# EAGLE design 16out_24V_4TE (EAGLE 5.04)
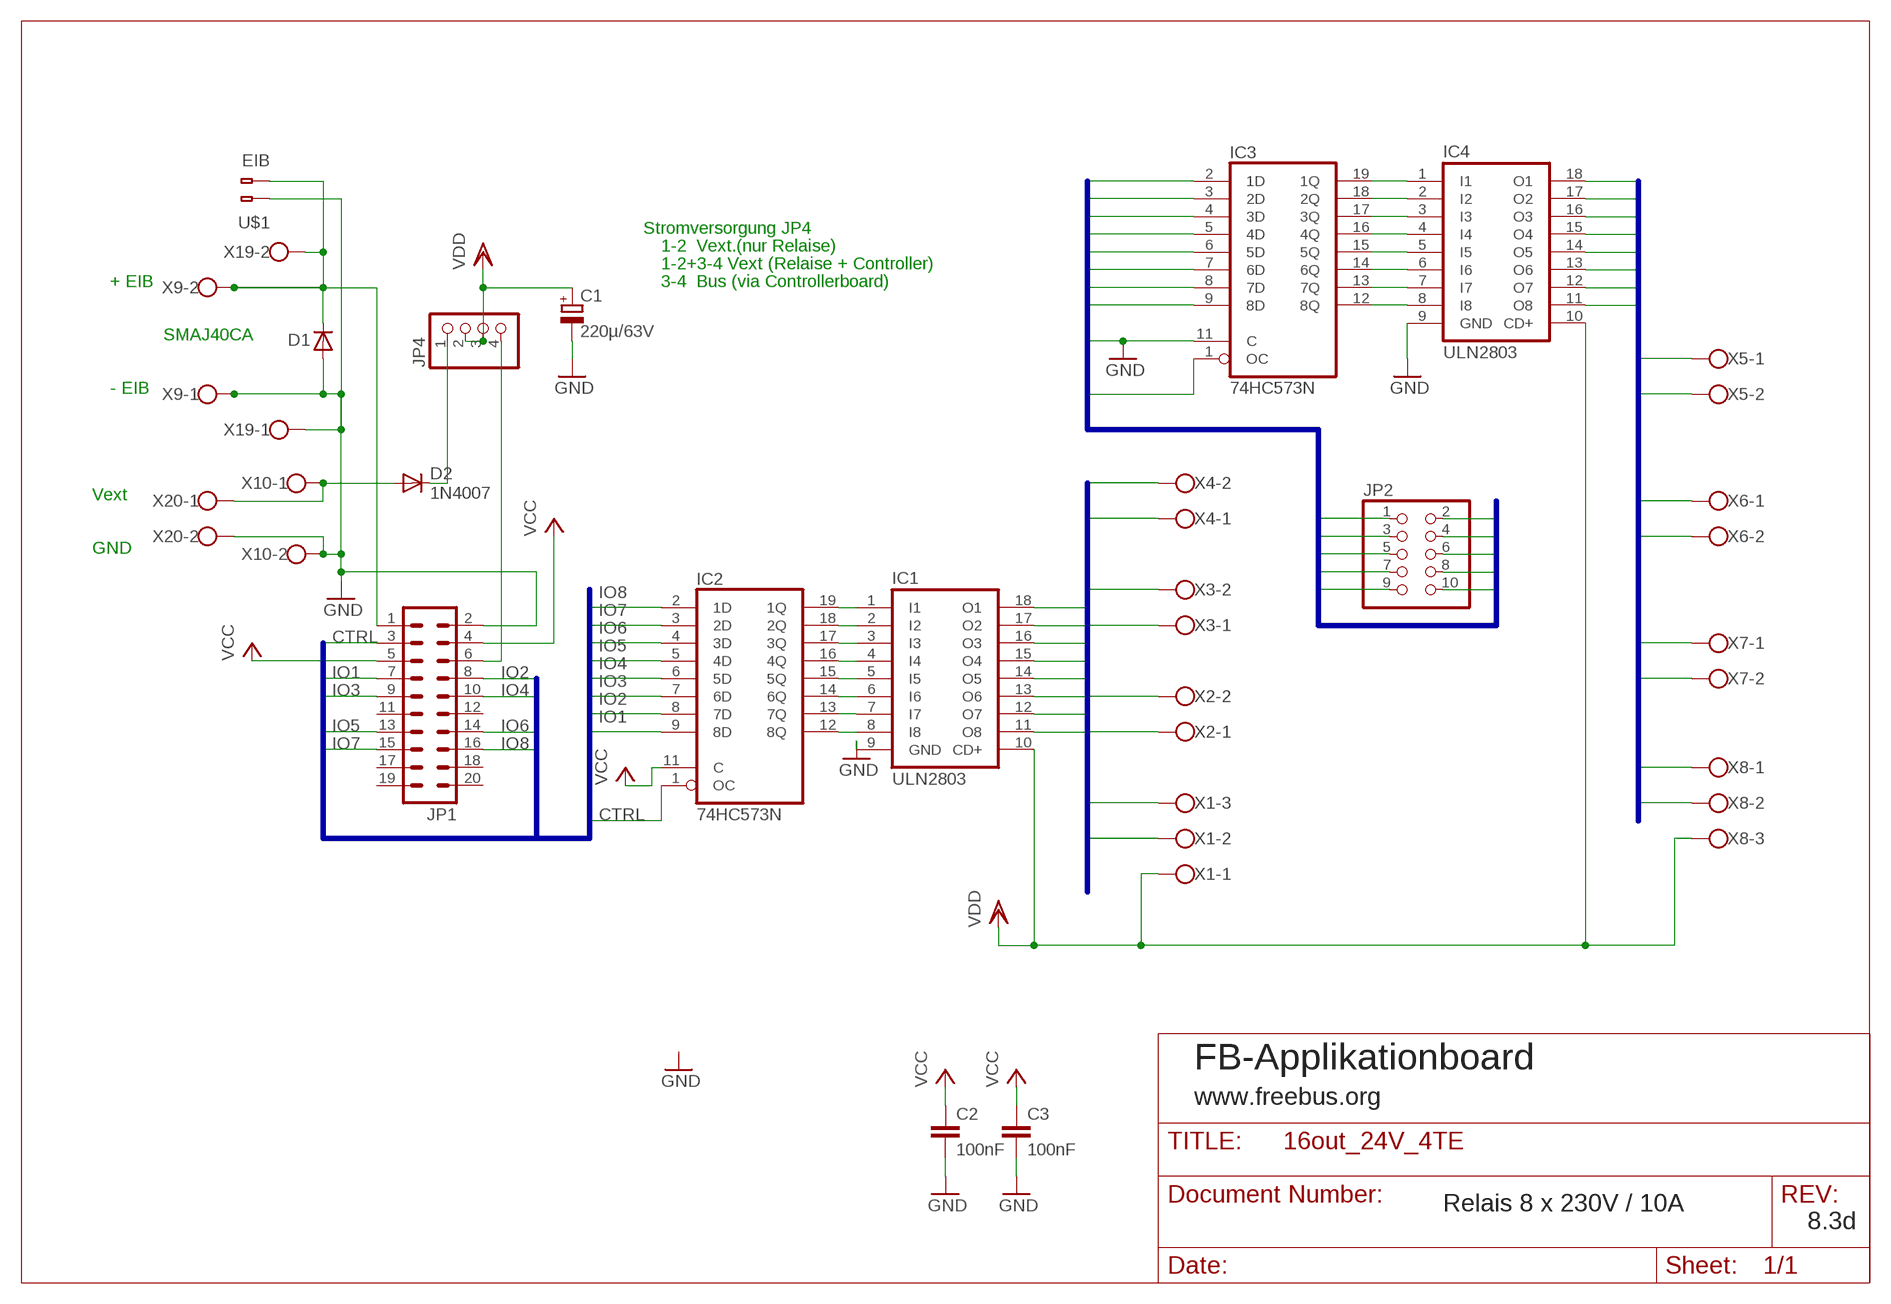
[diagram p0: schematic, sheet 1]

## Parts
C1  220µ/63V  CPOL-EUE5-10.5  [E5-10,5]
C2  100nF  C-EU050-024X044  [C050-024X044]
C3  100nF  C-EU050-024X044  [C050-024X044]
D1  D-SMB  [SMB]
D2  1N4007  1N4004  [DO41-10]
IC1  ULN2803  ULN2803A  [DIL18]
IC2  74HC573N  [DIL20]
IC3  74HC573N  [DIL20]
IC4  ULN2803  ULN2803A  [DIL18]
JP1  ML20  [ML20]
JP2  PINHD-2X5  [2X05]
JP4  PINHD-1X4  [1X04]
U$1  EIB  [BUSKLEMME243-724]
X1  W237-03P  [W237-133]
X2  W237-102  [W237-102]
X3  W237-102  [W237-102]
X4  W237-102  [W237-102]
X5  W237-102  [W237-102]
X6  W237-102  [W237-102]
X7  W237-102  [W237-102]
X8  W237-03P  [W237-133]
X9  W237-102  [W237-102]
X10  W237-102  [W237-102]
X19  W237-102AKL007-2P  [AKL007-02]
X20  W237-102AKL007-2P  [AKL007-02]

## Nets
CTRL: IC2.1(OC) JP1.3
GND: C1.- C2.2 C3.2 D1.2(A) IC1.9(GND) IC3.11(C) IC4.9(GND) JP1.2 JP2.9 U$1.1(B-1) X9.1 X10.2 X19.1 X20.2
IO1: IC2.9(8D) JP1.7
IO2: IC2.8(7D) JP1.8
IO3: IC2.7(6D) JP1.9
IO4: IC2.6(5D) JP1.10
IO5: IC2.5(4D) JP1.13
IO6: IC2.4(3D) JP1.14
IO7: IC2.3(2D) JP1.15
IO8: IC2.2(1D) JP1.16
IO9: IC3.9(8D) JP2.1
IO10: IC3.8(7D) JP2.2
IO11: IC3.7(6D) JP2.3
IO12: IC3.6(5D) JP2.4
IO13: IC3.5(4D) JP2.5
IO14: IC3.4(3D) JP2.6
IO15: IC3.3(2D) JP2.7
IO16: IC3.2(1D) JP2.8
N$1: IC3.19(1Q) IC4.1(I1)
N$2: IC3.18(2Q) IC4.2(I2)
N$3: IC3.17(3Q) IC4.3(I3)
N$4: IC3.16(4Q) IC4.4(I4)
N$5: IC3.15(5Q) IC4.5(I5)
N$6: IC3.14(6Q) IC4.6(I6)
N$7: IC3.13(7Q) IC4.7(I7)
N$8: IC3.12(8Q) IC4.8(I8)
N$17: D2.A X10.1 X20.1
N$20: D1.1(C) JP1.1 U$1.2(B-2) X9.2 X19.2
N$25: D2.C JP4.1
N$27: JP1.4
N$29: JP1.6 JP4.4
N$30: IC1.1(I1) IC2.19(1Q)
N$31: IC1.2(I2) IC2.18(2Q)
N$32: IC1.3(I3) IC2.17(3Q)
N$33: IC1.4(I4) IC2.16(4Q)
N$34: IC1.5(I5) IC2.15(5Q)
N$36: IC1.6(I6) IC2.14(6Q)
N$37: IC1.7(I7) IC2.13(7Q)
N$38: IC1.8(I8) IC2.12(8Q)
PWM: IC3.1(OC) JP2.10
R1: IC1.11(O8) X1.2
R2: IC1.12(O7) X1.3
R3: IC1.13(O6) X2.1
R4: IC1.14(O5) X2.2
R5: IC1.15(O4) X3.1
R6: IC1.16(O3) X3.2
R7: IC1.17(O2) X4.1
R8: IC1.18(O1) X4.2
R9: IC4.11(O8) X5.1
R10: IC4.12(O7) X5.2
R11: IC4.13(O6) X6.1
R12: IC4.14(O5) X6.2
R13: IC4.15(O4) X7.1
R14: IC4.16(O3) X7.2
R15: IC4.17(O2) X8.1
R16: IC4.18(O1) X8.2
VCC: C2.1 C3.1 IC2.11(C) JP1.5
VDD: C1.+ IC1.10(CD+) IC4.10(CD+) JP4.2 JP4.3 X1.1 X8.3
Unconnected: JP1.11 JP1.12 JP1.17 JP1.18 JP1.19 JP1.20

## Buses
R[1..8]
IO[1..8],CTRL
R[9..16]
IO[9..16],PWM,GND

## Notes on the sheet
- Stromversorgung JP4
- 1-2  Vext.(nur Relaise)
- 1-2+3-4 Vext (Relaise + Controller)
- + EIB | 3-4  Bus (via Controllerboard)
- SMAJ40CA
- - EIB
- Vext
- GND
- FB-Applikationboard
- www.freebus.org
- Relais 8 x 230V / 10A
- 8.3d

## Power pins joined to a net without a drawn wire
GND: IC2.10(GND) IC3.10(GND)
VCC: IC2.20(VCC) IC3.20(VCC)

## Library data of the parts
C1 = rcl:CPOL-EU: POLARIZED CAPACITOR, European symbol
C2 C3 = rcl:C-EU: CAPACITOR, European symbol
D1 = semicon-smd-ipc:D-: DIODE unfilled
D2 = diode:1N4004: DIODE general purpose rectifier, 1 A
IC1 IC4 = uln-udn:ULN2803A: DRIVER ARRAY
IC2 IC3 = 74xx-eu:74*573: 8-bit D latch BUS DRIVER
JP1 = con-harting-ml:ML20: HARTING
JP2 = pinhead:PINHD-2X5: PIN HEADER
JP4 = pinhead:PINHD-1X4: PIN HEADER
U$1 = con-wago:EIB
X1 X8 = con-wago-508:W237-03P: WAGO SREW CLAMP
X2-X7 X9 X10 X19 X20 = con-wago-500:W237-102: WAGO SCREW CLAMP

## Net classes
0 SELV: width 0.406 mm
1 230Vac: width 1.93 mm, clearance 5.08 mm to class 0, clearance 1.905 mm

## Board
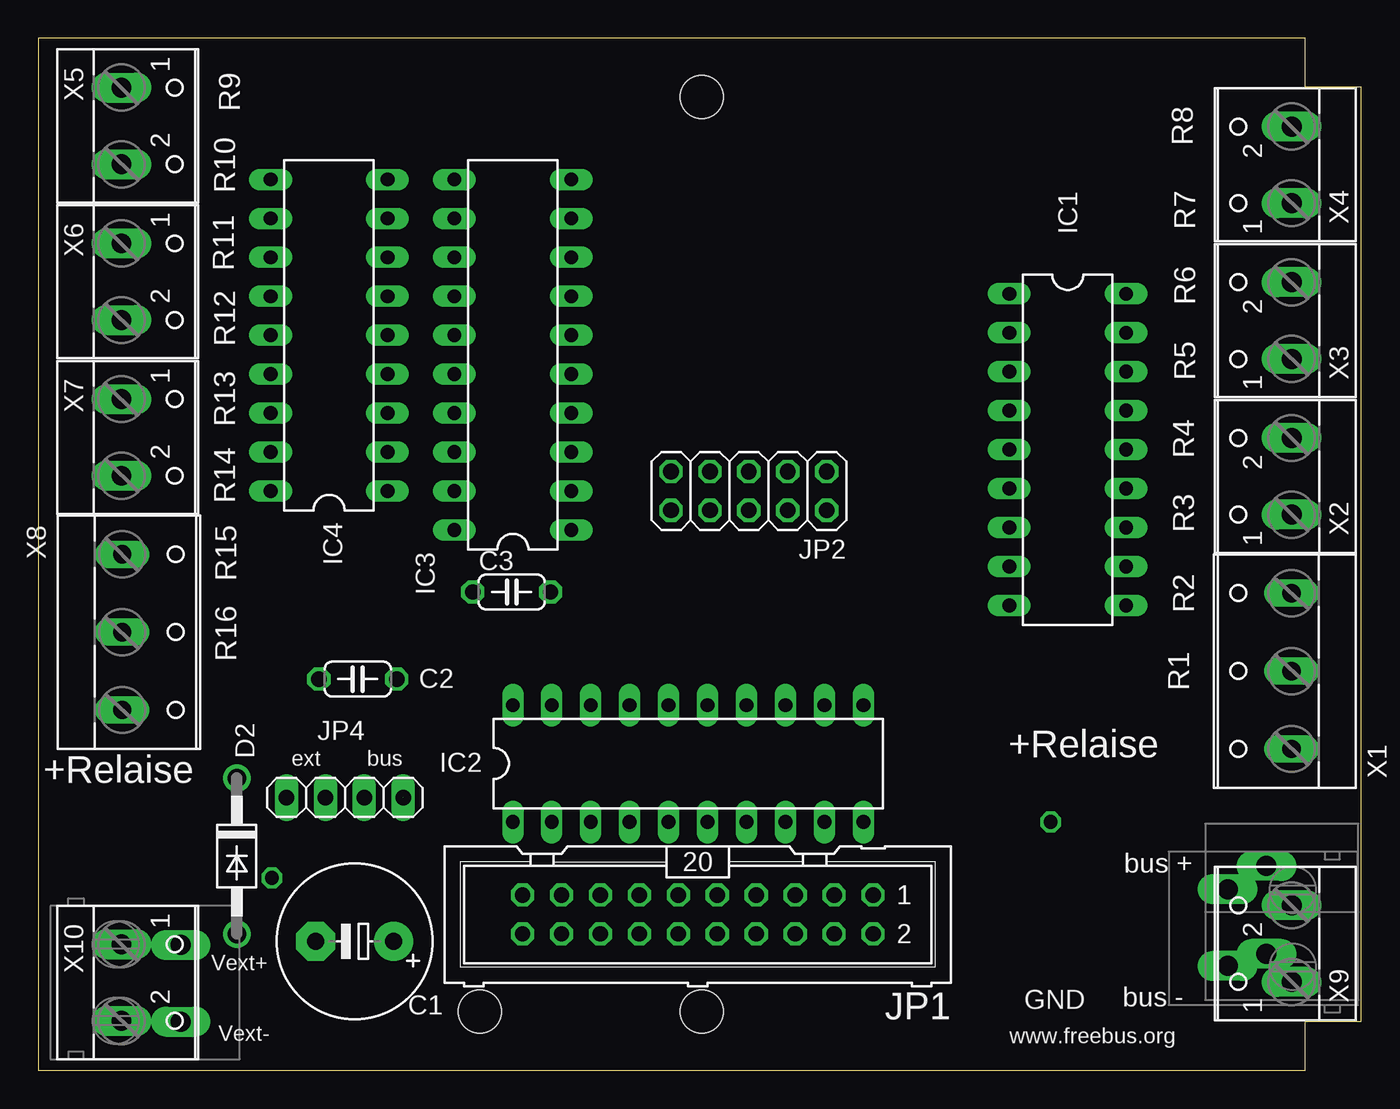
[diagram p1: board, top side]
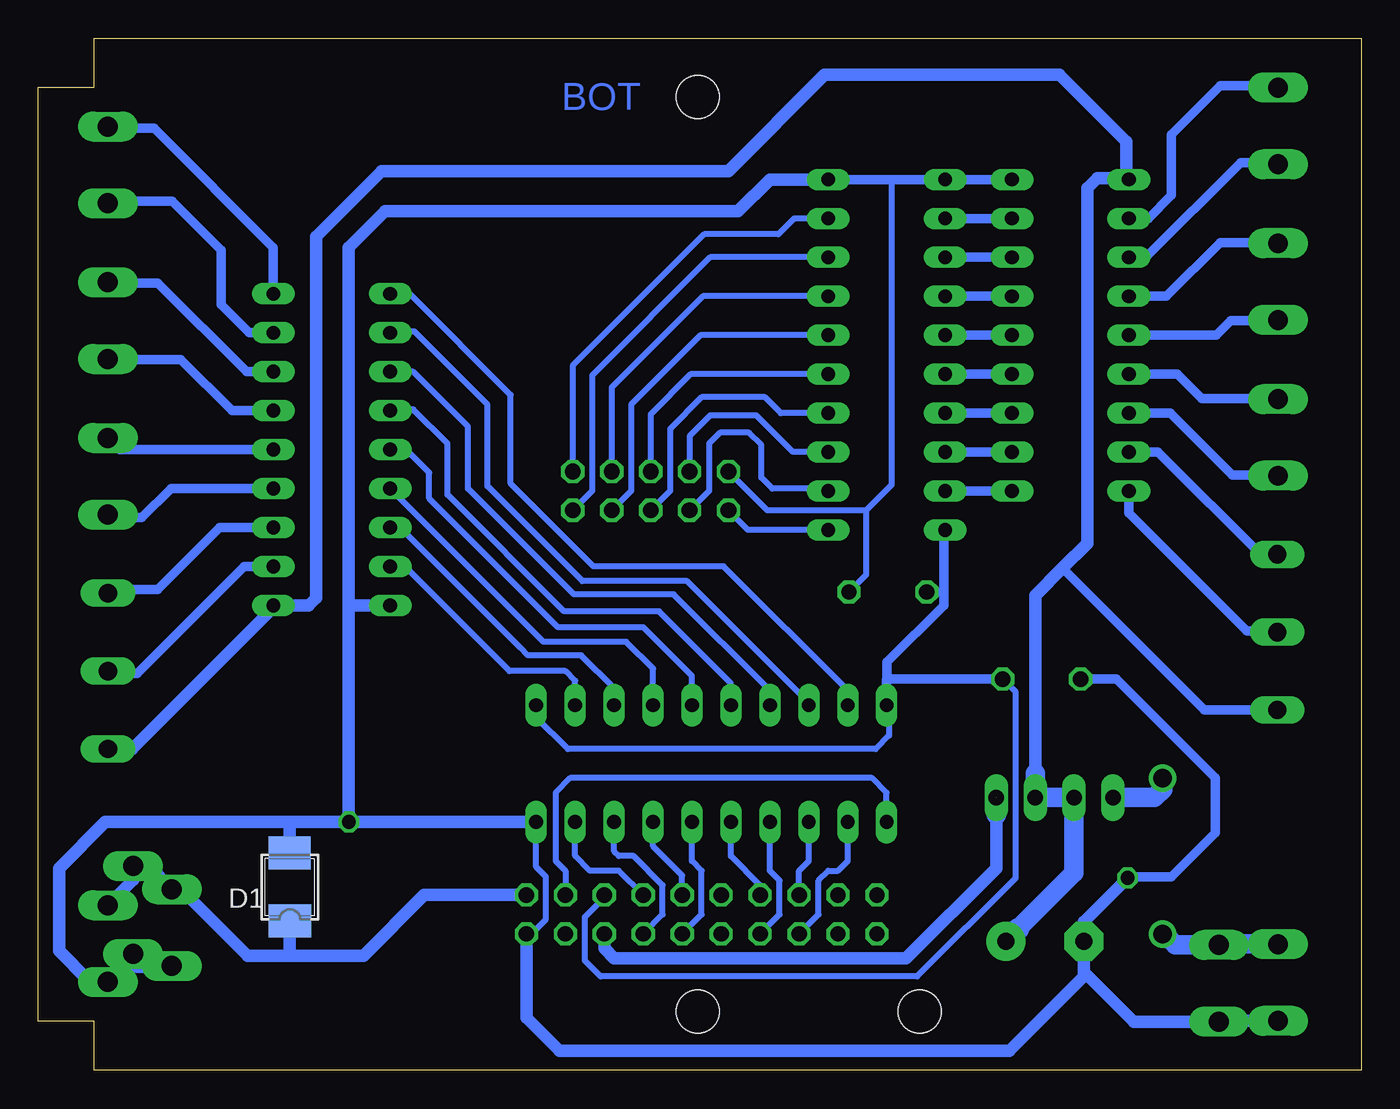
[diagram p2: board, bottom side, seen from below]

Size 86.28 x 67.31 mm. Coordinates in mm from the lower left corner, seen from the top.
Outline: 0,0.01 82.64,0 82.64,3.18 86.28,3.18 86.28,64.13 82.64,64.13 82.64,67.31 0,67.31 0,0.01
Copper layers (1*16): Top 0.035mm / dielectric 1.5mm / Bottom 0.035mm
Design rules "default": minimum track width 10mil, minimum drill 24mil, track to track 16mil, track to pad 12mil, pad to pad 16mil, via to via 16mil, smd to smd 8mil, copper to edge 20mil, drill to drill 10mil, minimum pad ring 10mil, minimum via ring 8mil, stop-mask expansion 4mil, vias tented up to drill 0mil, thermal gap 10mil
Holes 2.8 mm at 43.27,3.81 43.27,63.5 28.79,3.81
tRestrict: area 39,52.7 to 48,61.2

### Footprints (pad centres in the part's own frame; a part is rotated, then mirrored left to right if it is on the bottom)
E5-10,5 = drill 1.1 pad 2.54 round: + -2.54,0 | drill 1.1 pad 2.54 octagon: - 2.54,0
C050-024X044 = drill 1 octagon: 1 -2.54,0; 2 2.54,0
SMB = smd 2.159 x 2.743: 1 -2.311,-0.127; 2 2.108,-0.102
DO41-10 = drill 1.2 round: A 5.08,0; C -5.08,0
DIL18 = drill 0.9 long: 1 -10.16,-3.81; 2 -7.62,-3.81; 3 -5.08,-3.81; 4 -2.54,-3.81; 5 0,-3.81; 6 2.54,-3.81; 7 5.08,-3.81; 8 7.62,-3.81; 9 10.16,-3.81; 10 10.16,3.81; 11 7.62,3.81; 12 5.08,3.81; 13 2.54,3.81; 14 0,3.81; 15 -2.54,3.81; 16 -5.08,3.81; 17 -7.62,3.81; 18 -10.16,3.81
DIL20 = drill 0.9 long: 1 -11.43,-3.81; 2 -8.89,-3.81; 3 -6.35,-3.81; 4 -3.81,-3.81; 5 -1.27,-3.81; 6 1.27,-3.81; 7 3.81,-3.81; 8 6.35,-3.81; 9 8.89,-3.81; 10 11.43,-3.81; 11 11.43,3.81; 12 8.89,3.81; 13 6.35,3.81; 14 3.81,3.81; 15 1.27,3.81; 16 -1.27,3.81; 17 -3.81,3.81; 18 -6.35,3.81; 19 -8.89,3.81; 20 -11.43,3.81
ML20 = drill 1 octagon: 1 -11.43,-1.27; 2 -11.43,1.27; 3 -8.89,-1.27; 4 -8.89,1.27; 5 -6.35,-1.27; 6 -6.35,1.27; 7 -3.81,-1.27; 8 -3.81,1.27; 9 -1.27,-1.27; 10 -1.27,1.27; 11 1.27,-1.27; 12 1.27,1.27; 13 3.81,-1.27; 14 3.81,1.27; 15 6.35,-1.27; 16 6.35,1.27; 17 8.89,-1.27; 18 8.89,1.27; 19 11.43,-1.27; 20 11.43,1.27
2X05 = drill 1.016 octagon: 1 -5.08,-1.27; 2 -5.08,1.27; 3 -2.54,-1.27; 4 -2.54,1.27; 5 0,-1.27; 6 0,1.27; 7 2.54,-1.27; 8 2.54,1.27; 9 5.08,-1.27; 10 5.08,1.27
1X04 = drill 1.016 long: 1 -3.81,0; 2 -1.27,0; 3 1.27,0; 4 3.81,0
BUSKLEMME243-724 = drill 1.3 long: 1 -2.875,0; 2 2.875,0
W237-133 = drill 1.194 long: 1 -5.08,-0.635; 2 0,-0.635; 3 5.08,-0.635
W237-102 = drill 1.3 long: 1 -2.5,-1.27; 2 2.5,-1.27
AKL007-02 = drill 1.3 long: 1 -2.45,2.325; 2 2.55,2.325

### Placement (x,y rotation side)
C1  20.63,8.41 180 top
C2  20.84,25.51 180 top
C3  30.87,31.19 0 top
D1  70,12.06 90 bottom
D2  12.95,13.97 270 top
IC1  67.14,40.48 270 top
IC2  42.38,20 0 top
IC3  30.95,46.67 90 top
IC4  18.96,47.94 90 top
JP1  43.02,10.16 180 top
JP2  46.35,37.78 180 top
JP4  20,17.78 0 top
U$1  80.11,10.45 90 top
X1  81.11,26.04 90 top
X2  80.48,38.73 90 top
X3  80.48,48.89 90 top
X4  80.48,59.05 90 top
X5  6.69,61.59 270 top
X6  6.69,51.43 270 top
X7  6.69,41.27 270 top
X8  6.11,28.58 270 top
X9  80.48,8.26 90 top
X10  6.69,5.71 270 top
X19  79.9,9.25 90 top
X20  6.96,5.71 270 top

### Tracks (layer width: path | path; a pad name or v marks a point on that pad's centre or on a via)
CTRL
  Bottom 0.406: IC2.1 30.95,18.1 31.9,19.05 51.59,19.05 52.54,18.1 52.54,13.65 51.91,13.02 JP1.3
GND  (via drill 0.9)
  Bottom 0.406: 32.3,36.51 30.63,38.18 30.63,57.94 30.79,58.1 | JP1.2 54.13,8.89 53.17,9.84 53.17,12.62 53.81,13.26 IC2.10 | 65.88,16.19 66.03,16.35 | C3.2 32.3,32.31 32.3,36.51 | JP2.9 | JP2.9 38.73,36.51 32.3,36.51
  Bottom 0.61: IC4.9 IC3.11 30.79,58.1 IC3.10 | C2.2 15.98,25.51 9.52,19.05 9.52,15.48 12.38,12.62 15.15,12.62 v15.23,12.54
  Bottom 0.813: 80,6.83 | 80,6.83 81.08,5.75 X9.1 81.87,5.87 83.02,5.87 84.92,7.78 84.92,13.18 81.91,16.19 69.69,16.19 | IC3.10 38.57,58.1 40.63,56.04 63.65,56.04 66.03,53.66 66.03,30.48 | X10.2 9.24,3.21 X20.2 14.83,3.17 18.09,6.43 C1.- | C1.- | C1.- 18.09,9.68 v15.23,12.54 | C1.- 18.09,6.11 22.93,1.27 52.3,1.27 54.45,3.41 JP1.2 | IC2.10 65.88,16.19 | 77.23,6.46 X19.1 79.74,6.8 79.77,6.83 | 80,6.83 80,7.47 U$1.1 | 69.69,16.19 v66.03,16.19 66.03,16.35 66.03,30.48 | IC1.9 65.88,30.32 66.03,30.48 | D1.2 69.9,15.98 69.69,16.19
  Bottom 1.016: 80,6.83 79.77,6.83 79.21,6.83
IO1
  Bottom 0.406: JP1.7 48.41,13.02 50.32,13.02 51.27,13.97 IC2.9
IO2
  Bottom 0.406: JP1.8 45.55,10.16 45.55,12.06 47.46,13.97 48.41,13.97 48.73,14.29 IC2.8
IO3
  Bottom 0.406: JP1.9 44.28,12.7 46.19,14.61 IC2.7
IO4
  Bottom 0.406: JP1.10 43.02,10.16 43.02,13.02 43.65,13.65 IC2.6
IO5
  Bottom 0.406: JP1.13 39.2,12.06 41.11,13.97 IC2.5
IO6
  Bottom 0.406: JP1.14 37.94,10.16 37.94,12.38 38.57,13.02 IC2.4
IO7
  Bottom 0.406: JP1.15 36.66,13.02 36.03,13.65 IC2.3
IO8
  Bottom 0.406: JP1.16 35.39,10.16 35.39,12.38 34.76,13.02 34.12,13.02 33.49,13.65 IC2.2
IO9
  Bottom 0.406: IC3.9 36.98,55.56 38.01,54.53 42.86,54.53 51.43,45.96 JP2.1 | JP2.1
IO10
  Bottom 0.406: IC3.8 42.46,53.02 50.16,45.32 50.16,37.78 JP2.2
IO11
  Bottom 0.406: IC3.7 42.94,50.48 48.89,44.53 JP2.3 | JP2.3
IO12
  Bottom 0.406: IC3.6 43.09,47.94 47.62,43.42 47.62,37.78 JP2.4
IO13
  Bottom 0.406: IC3.5 43.73,45.4 46.35,42.78 JP2.5 | JP2.5
IO14
  Bottom 0.406: IC3.4 37.86,42.86 38.89,43.89 43.02,43.89 45.08,41.83 45.08,37.78 JP2.6
IO15
  Bottom 0.406: IC3.3 37.06,40.32 39.44,42.7 42.46,42.7 43.81,41.35 JP2.7 | JP2.7
IO16
  Bottom 0.406: IC3.2 34.76,37.94 38.41,37.94 39.13,38.66 39.13,40.8 39.92,41.59 41.82,41.59 42.54,40.88 42.54,37.78 JP2.8
N$1
  Bottom 0.61: IC4.1 IC3.19
N$2
  Bottom 0.61: IC4.2 IC3.18
N$3
  Bottom 0.61: IC4.3 IC3.17
N$4
  Bottom 0.61: IC4.4 IC3.16
N$5
  Bottom 0.61: IC4.5 IC3.15
N$6
  Bottom 0.61: IC4.6 IC3.14
N$7
  Bottom 0.61: IC4.7 IC3.13
N$8
  Bottom 0.61: IC4.8 IC3.12
N$17
  Bottom 0.61: 9.04,8.26 9.13,8.17 X20.1
  Bottom 0.813: 5.39,8.26 X10.1
  Bottom 1.27: 5.39,8.26 9.04,8.26 | D2.A 12.85,8.89 12.13,8.17 X20.1
N$20
  Bottom 0.813: JP1.1 61.11,11.43 65.08,7.46 70,7.46 | 70,7.46 72.62,7.46 76.99,11.83 77.55,11.83 X19.2 79.1,13.33 U$1.2 80.11,12.4 X9.2 | D1.1 69.88,7.59 70,7.46
N$25
  Bottom 1.27: D2.C 12.95,18.32 13.49,17.78 | 13.49,17.78 | 13.49,17.78 JP4.1
N$29  (1 unrouted)
  Bottom 0.813: JP1.6 49.37,7.94 48.73,7.3 29.68,7.3 23.81,13.18 23.81,16.67
  Bottom 1.27: 23.81,16.67 JP4.4
N$30
  Bottom 0.406: IC2.19 33.49,24.77 41.59,32.86 50.08,32.86 55.48,38.26 55.48,44.05 62.06,50.64 IC1.1 | IC1.1
N$31
  Bottom 0.406: IC2.18 36.03,23.97 43.97,31.91 50.79,31.91 56.98,38.1 56.98,43.42 61.75,48.18 63.26,48.18 IC1.2
N$32
  Bottom 0.406: IC2.17 38.57,24.77 44.84,31.04 51.35,31.04 58.25,37.94 58.25,41.99 61.83,45.56 IC1.3 | IC1.3
N$33
  Bottom 0.406: IC2.16 41.11,25.24 45.79,29.92 51.98,29.92 59.6,37.54 59.6,40.88 61.83,43.1 63.26,43.1 IC1.4
N$34
  Bottom 0.406: IC2.15 43.65,25.72 46.82,28.89 52.38,28.89 60.8,37.31 60.8,38.97 62.3,40.48 IC1.5 | IC1.5
N$36
  Bottom 0.406: IC2.14 46.19,26.19 47.94,27.94 53.33,27.94 IC1.6
N$37
  Bottom 0.406: IC2.13 48.73,24.92 50.87,27.07 54.37,27.07 54.84,27.54 62.7,35.4 IC1.7 | IC1.7
N$38
  Bottom 0.406: IC2.12 51.27,25.4 51.91,26.04 55.56,26.04 62.3,32.78 63.26,32.78 IC1.8
PWM
  Bottom 0.406: IC3.1 40,35.24 JP2.10
R1
  Bottom 0.61: IC1.11 72.86,32.86 79.84,25.88 81.59,25.88 X1.2
R2
  Bottom 0.61: IC1.12 74.45,35.4 78.5,31.35 81.51,31.35 X1.3
R3
  Bottom 0.61: IC1.13 77.62,37.94 79.53,36.04 81.55,36.04 X2.1
R4
  Bottom 0.61: IC1.14 81,40.48 X2.2
R5
  Bottom 0.61: IC1.15 73.65,43.02 76.99,46.35 81.71,46.35 X3.1
R6
  Bottom 0.61: IC1.16 72.7,45.56 78.5,51.36 81.71,51.36 X3.2
R7
  Bottom 0.61: IC1.17 72.54,48.1 74.37,49.93 74.37,53.5 77.54,56.67 81.63,56.67 X4.1
R8
  Bottom 0.61: IC1.18 70.95,53.66 78.73,61.44 81.63,61.44 X4.2
R9
  Bottom 0.61: IC4.11 13.88,55.56 12.38,57.07 12.38,61.04 9.2,64.21 5.54,64.21 X5.1
R10
  Bottom 0.61: IC4.12 14.04,53.02 7.85,59.21 5.54,59.21 X5.2
R11
  Bottom 0.61: IC4.13 12.69,50.48 9.2,53.98 5.46,53.98 X6.1
R12
  Bottom 0.61: IC4.14 9.44,47.94 8.49,48.89 5.46,48.89 X6.2
R13
  Bottom 0.61: IC4.15 11.98,45.4 10.39,43.81 5.46,43.81 X7.1
R14
  Bottom 0.61: IC4.16 12.46,42.86 8.41,38.81 5.46,38.81 X7.2
R15
  Bottom 0.61: IC4.17 13.25,40.32 6.42,33.5 5.63,33.5 X8.1
R16
  Bottom 0.61: IC4.18 15.15,36.35 7.46,28.65 5.55,28.65 X8.2
VCC
  Bottom 0.406: 53.81,24.13 IC2.11 53.81,23.02 51.75,20.96 31.66,20.96 30.79,21.83 30.79,23.65 IC2.20 | JP1.5 49.37,11.27 50.63,10 50.63,7.14 49.6,6.11 28.97,6.11 22.54,12.54 22.54,24.67 C2.1
  Bottom 0.61: 30.95,24.61 30.95,25.48 30.92,25.51 | 27.14,35.08 IC3.20 27.22,35.16 27.22,31.27 | C2.1 30.92,25.51 | 30.92,25.51 30.92,26.62 27.22,30.32 27.22,31.27 | C3.1 27.3,31.19 27.22,31.27
  Bottom 0.813: 30.95,24.61 IC2.20
VDD
  Bottom 0.61: IC1.10 70.95,30.16 | IC4.10 15.31,58.26 | X8.3 10.23,23.5 19.48,32.74
  Bottom 0.813: 70.95,30.16 80.16,20.96 X1.1 | IC1.10 68.65,30.32 68.18,30.8 68.18,54.37 63.89,58.66 41.27,58.66 35,64.93 19.68,64.93 15.31,60.56 15.31,58.26 | 21.27,19.37 21.27,30.96 19.48,32.74 17.85,34.37 17.85,57.55 17.22,58.18 15.23,58.18 IC4.10
  Bottom 1.27: 21.27,19.37 JP4.3 JP4.2 18.73,12.86 22.38,9.21
  Bottom 1.422: 22.38,9.21 C1.+

### Text on the board
Bottom: BOT
tPlace: R9 | R8 | R10 | R7 | R11 | R6 | R12 | R5 | R13 | R4 | R14 | R3 | R15 | R2 | R16 | R1 | +Relaise | ext | bus | +Relaise | bus + | Vext+ | bus - | Vext-
tNames: GND | www.freebus.org
Document: A5 | A4 | A6 | A3 | A7 | A2 | A8 | A1 | EIB + | Vext+ | EIB - | Vext-
Drill_legend: Bohrlegende | Datum: 10.01.2009 22:11:37 | 2.8000 mm / 110.236 mil | 1.6000 mm / 62.992 mil | 1.3000 mm / 51.181 mil | 1.2000 mm / 47.244 mil | 1.1000 mm / 43.307 mil | 1.0000 mm / 39.370 mil | 0.9000 mm / 35.433 mil | 0.5000 mm / 19.685 mil